# EAGLE design Laser engraver V2 (EAGLE 6.5.0)
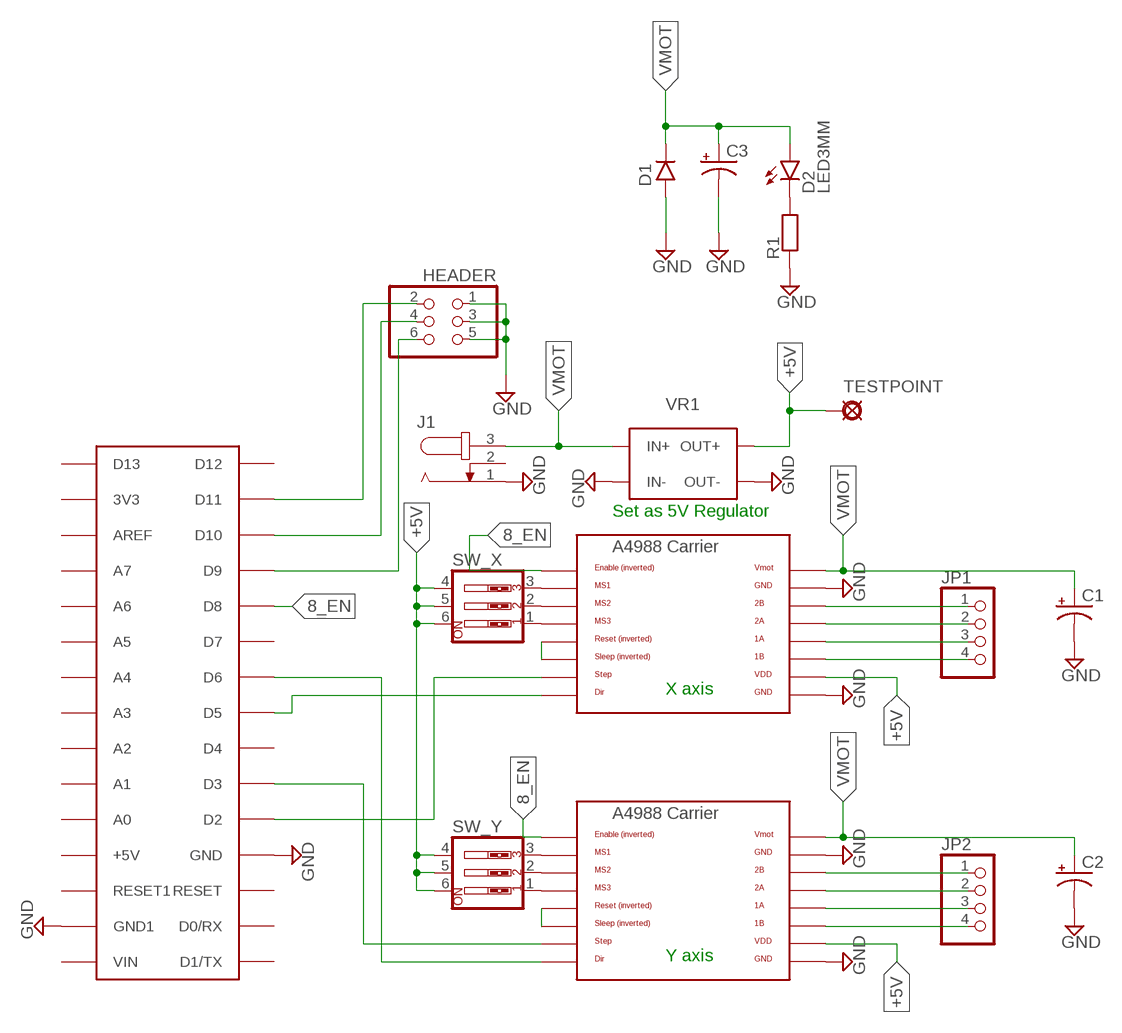
[diagram p0: schematic, sheet 1]

## Parts
C1  0501  [050_020_1]
C2  0501  [050_020_1]
C3  0631  [063_025]
D1  1N400X.3  [DO41-3]
D2  LED3MM  [LED3MM]
HEADER  PINHD-2X3  [2X03]
J1  JACK-PLUG0  [SPC4077]
JP1  PINHD-1X4  [1X04]
JP2  PINHD-1X4  [1X04]
MOTOR_X  A4988BREAKOUT  [A4988BREAKOUT]
MOTOR_Y  A4988BREAKOUT  [A4988BREAKOUT]
R1  6MM-EU  [R0207/3]
SW_X  SW_DIP-3  [EDG-03]
SW_Y  SW_DIP-3  [EDG-03]
TESTPOINT  PAD  [SQUARE]
U$3  ARDUINONANO  [PDIP-32]
VR1  VOLTAGE_REG_BANGGOOD  [VOLTAGE_REG]

## Nets
8_EN: MOTOR_X.EN MOTOR_Y.EN U$3.D8
+5V: MOTOR_X.VDD MOTOR_Y.VDD SW_X.4 SW_X.5 SW_X.6 SW_Y.4 SW_Y.5 SW_Y.6 TESTPOINT.1(PAD) VR1.O+1(OUT+) VR1.O+2(OUT+)
GND: C1.- C2.- C3.- D1.A HEADER.1 HEADER.3 HEADER.5 J1.1 MOTOR_X.GND MOTOR_X.GND@0(GND) MOTOR_Y.GND MOTOR_Y.GND@0(GND) R1.1 U$3.GND U$3.GND1 VR1.IN-1(IN-) VR1.IN-2(IN-) VR1.O-1(OUT-) VR1.O-2(OUT-)
N$1: MOTOR_X.MS3 SW_X.1
N$2: MOTOR_X.MS2 SW_X.2
N$3: MOTOR_X.MS1 SW_X.3
N$4: MOTOR_Y.MS3 SW_Y.1
N$5: MOTOR_Y.MS2 SW_Y.2
N$6: MOTOR_Y.MS1 SW_Y.3
N$7: HEADER.6 U$3.D9
N$8: MOTOR_X.DIR U$3.D5
N$9: MOTOR_X.STEP U$3.D2
N$10: MOTOR_Y.DIR U$3.D6
N$11: MOTOR_Y.STEP U$3.D3
N$12: MOTOR_Y.RST MOTOR_Y.SLP(SLEEP)
N$13: MOTOR_X.RST MOTOR_X.SLP(SLEEP)
N$14: HEADER.4 U$3.D10
N$15: HEADER.2 U$3.D11
N$17: JP1.1 MOTOR_X.2B
N$18: D2.K(C) R1.2
N$19: JP1.4 MOTOR_X.1B
N$20: JP1.3 MOTOR_X.1A
N$21: JP1.2 MOTOR_X.2A
N$22: JP2.1 MOTOR_Y.2B
N$23: JP2.2 MOTOR_Y.2A
N$24: JP2.3 MOTOR_Y.1A
N$25: JP2.4 MOTOR_Y.1B
VMOT: C1.+ C2.+ C3.+ D1.C D2.A J1.3 MOTOR_X.VMOT MOTOR_Y.VMOT VR1.IN+1(IN+) VR1.IN+2(IN+)
Unconnected: J1.2 U$3.3V3 U$3.+5V U$3.A0 U$3.A1 U$3.A2 U$3.A3 U$3.A4 U$3.A5 U$3.A6 U$3.A7 U$3.AREF U$3.D0/RX U$3.D1/TX U$3.D4 U$3.D7 U$3.D12 U$3.D13 U$3.RESET U$3.RESET1 U$3.VIN

## Notes on the sheet
- Set as 5V Regulator
- X axis
- Y axis

## Library data of the parts
C1 C2 = gm-caps-electro-pol:050: 0.22 - 100uF Xicon values at Mouser.com: 10V: 10 - 100uF; 16V: 2.2 - 47uF; 25V: 0.47 - 47uF; 50V: 0.22 - 22uF
C3 = gm-caps-electro-pol:063: 33 - 220uF Xicon values at Mouser.com 10V: 220uF; 16V: 100uF; 25V: 100uF; 50V: 33uF
D1 = gm-diodes:1N400X: Rectifier Diodes often used in power supply to prevent damage from reverse polarization
D2 = gm-diodes:LED
HEADER = pinhead:PINHD-2X3: PIN HEADER
J1 = con-jack:JACK-PLUG: DC POWER JACK Power Jack, DC, Right Angle, Through Hole, Rated 5A at 16VDC, PC Terminals Distributor: Farnell (www.Farnell.de) Drawing: 84N1161.pdf / 84N1162.pdf Manufacturer: SPC Technology (www.spctechnology.com) Type: SPC4077 / SPC 4078; OC_FARNELL: unknown; OC_NEWARK: unknown
JP1 JP2 = pinhead:PINHD-1X4: PIN HEADER
MOTOR_X MOTOR_Y = RepRapjr:A4988BREAKOUT
R1 = gm-resistors:6MM-EU: 6mm Resistors (European schematic symbol) Leads spaced 1-6 holes apart for 0.1" perfboard. Suitable for 1/4 watt resistors.
SW_X SW_Y = special:SW_DIP-3: DIP SWITCH
TESTPOINT = gm-supply:PAD: PAD use this package for pads with any purpose, including input, output, send or return various pad shapes: round, square, octogonal, long, and long offset
U$3 = jet-lib:ARDUINONANO
VR1 = GFE LOGO:VOLTAGE_REG_BANGGOOD

## Board
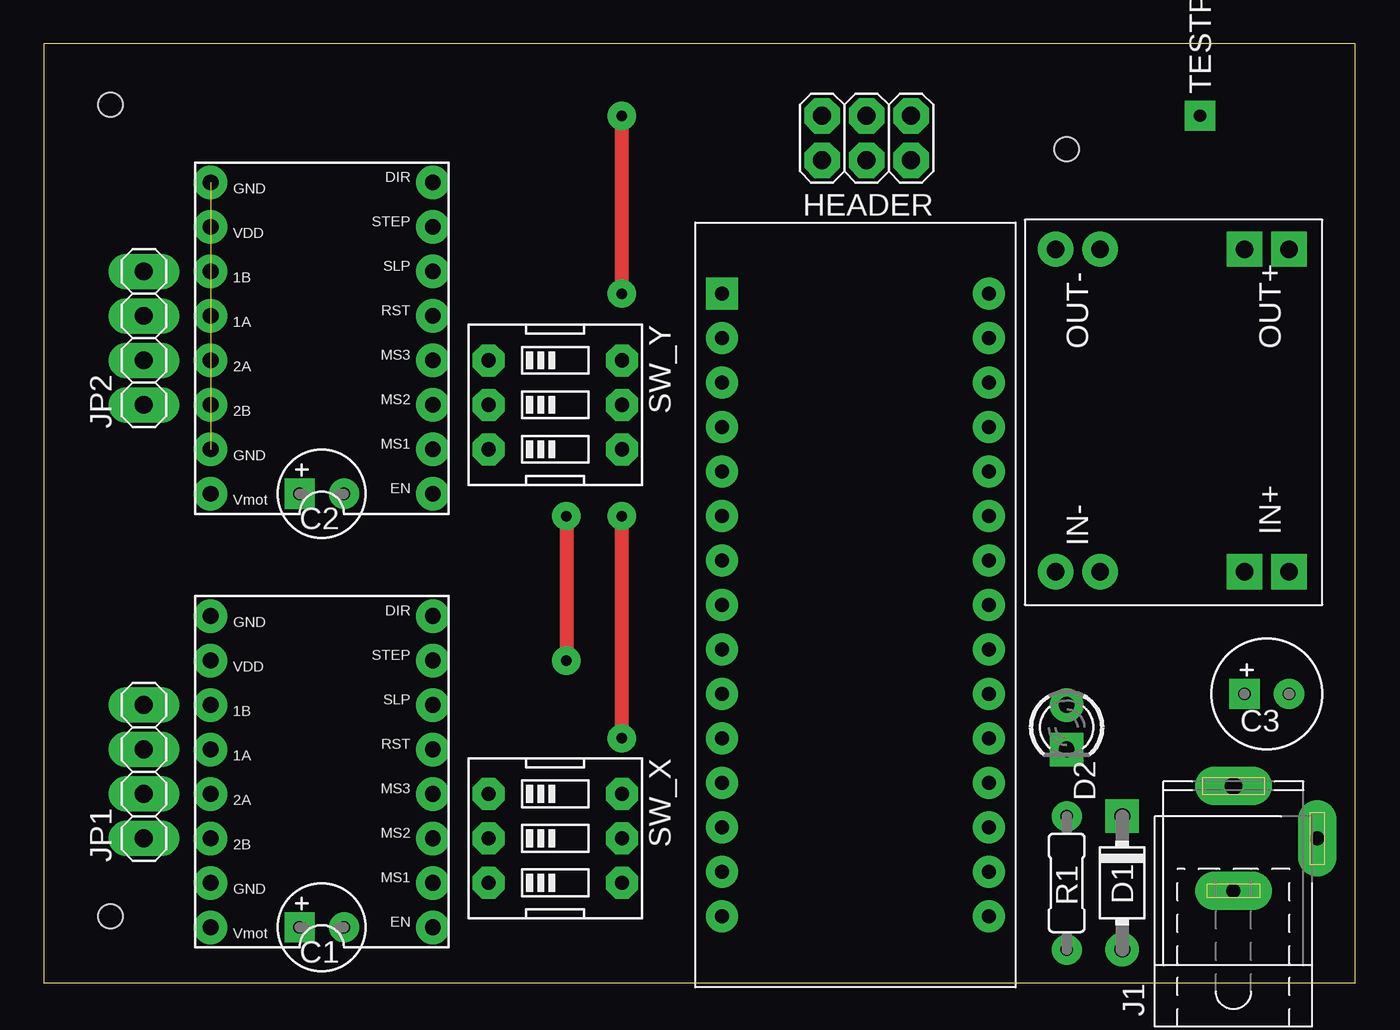
[diagram p1: board, top side]
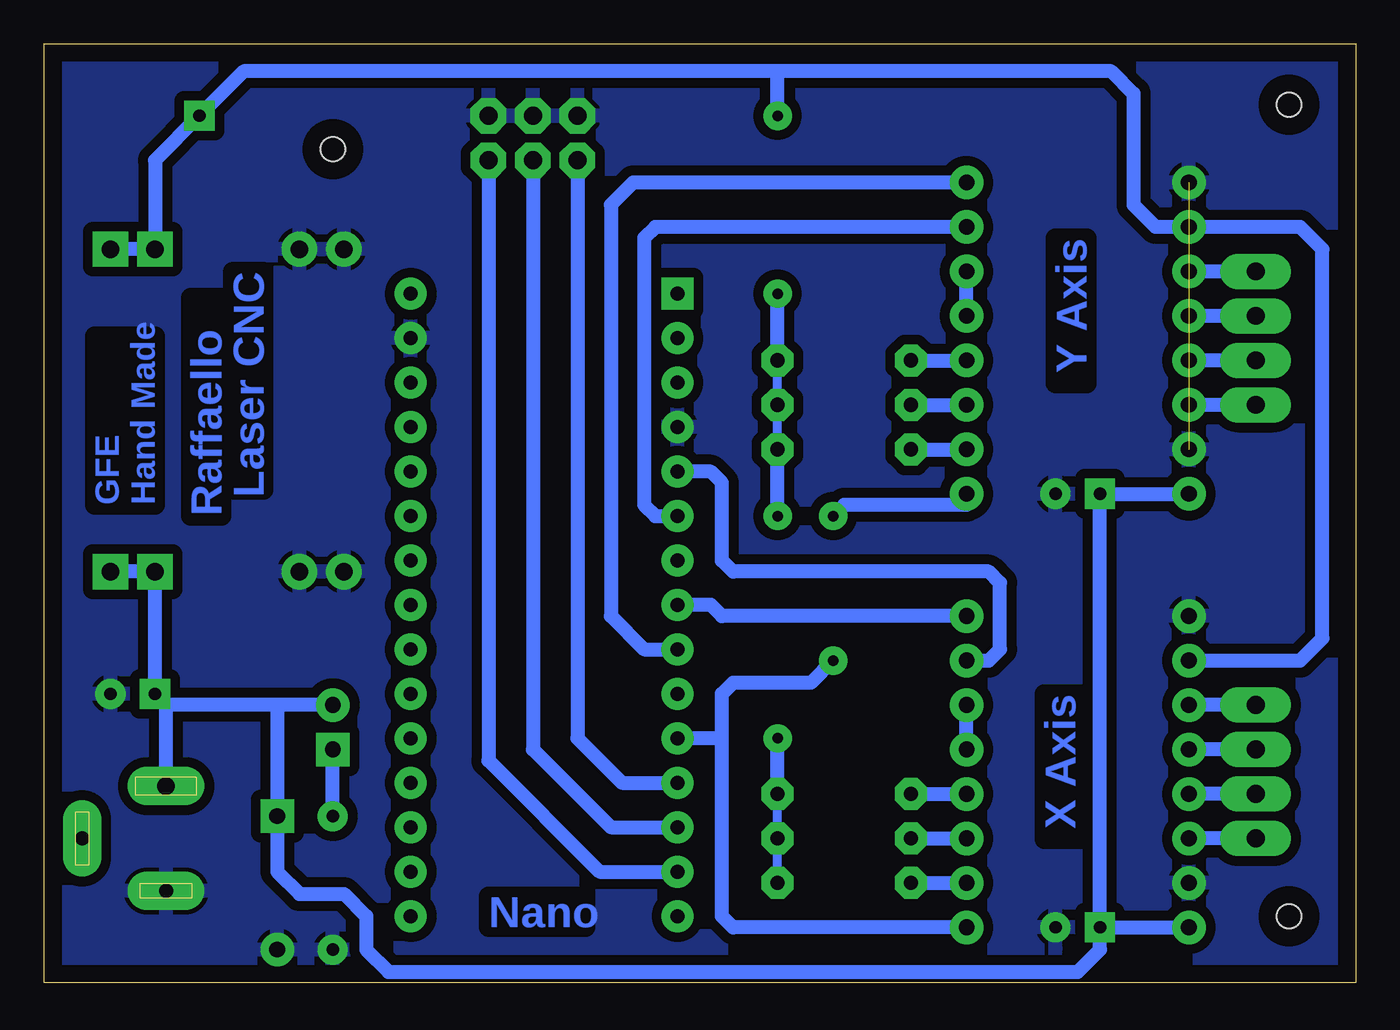
[diagram p2: board, bottom side, seen from below]

Size 74.91 x 53.65 mm. Coordinates in mm from the lower left corner, seen from the top.
Outline: 0,0 74.91,0 74.91,53.65 0,53.65 0,0
Copper layers (1*16): Top 0.035mm / dielectric 1.5mm / Bottom 0.035mm
Design rules "default *": minimum track width 10mil, minimum drill 24mil, track to track 8mil, track to pad 8mil, pad to pad 8mil, via to via 8mil, smd to smd 8mil, copper to edge 40mil, drill to drill 8mil, minimum pad ring 20mil, minimum via ring 20mil, stop-mask expansion 4mil, vias tented up to drill 0mil, thermal gap 10mil
Holes 1.4 mm at 3.81,3.81 58.42,47.62 3.81,50.16

### Footprints (pad centres in the part's own frame; a part is rotated, then mirrored left to right if it is on the bottom)
050_020_1 = drill 0.7 square: + -1.27,0 | drill 0.7: - 1.27,0
063_025 = drill 0.7 square: + -1.27,0 | drill 0.7: - 1.27,0
DO41-3 = drill 0.9: A 3.81,0 | drill 0.9 square: C -3.81,0
LED3MM = drill 0.9: A -1.27,0 | drill 0.9 square: K 1.27,0
2X03 = drill 1.016 octagon: 1 -2.54,-1.27; 2 -2.54,1.27; 3 0,-1.27; 4 0,1.27; 5 2.54,-1.27; 6 2.54,1.27
SPC4077 = drill 0.8 pad 2.184 long: 1 -3,0; 2 0,-4.8 | drill 1 pad 2.184 long: 3 3,0
1X04 = drill 1.016 long: 1 -3.81,0; 2 -1.27,0; 3 1.27,0; 4 3.81,0
A4988BREAKOUT = drill 0.9: 1A 8.89,1.27; 1B 11.43,1.27; 2A 6.35,1.27; 2B 3.81,1.27; DIR 16.51,-11.43; EN -1.27,-11.43; GND 16.51,1.27; GND@0 1.27,1.27; MS1 1.27,-11.43; MS2 3.81,-11.43; MS3 6.35,-11.43; RST 8.89,-11.43; SLP 11.43,-11.43; STEP 13.97,-11.43; VDD 13.97,1.27; VMOT -1.27,1.27
R0207/3 = drill 0.7: 1 -3.81,0; 2 3.81,0
EDG-03 = drill 0.813 octagon: 1 -2.54,-3.81; 2 0,-3.81; 3 2.54,-3.81; 4 2.54,3.81; 5 0,3.81; 6 -2.54,3.81
SQUARE = drill 0.7 square: 1 0,0
PDIP-32 = drill 0.8 pad 1.778: 3V3 15.24,-35.56; +5V 15.24,-10.16; A0 15.24,-30.48; A1 15.24,-27.94; A2 15.24,-25.4; A3 15.24,-22.86; A4 15.24,-20.32; A5 15.24,-17.78; A6 15.24,-15.24; A7 15.24,-12.7; AREF 15.24,-33.02; D0/RX 0,-5.08; D2 0,-12.7; D3 0,-15.24; D4 0,-17.78; D5 0,-20.32; D6 0,-22.86; D7 0,-25.4; D8 0,-27.94; D9 0,-30.48; D10 0,-33.02; D11 0,-35.56; D12 0,-38.1; D13 15.24,-38.1; GND 0,-10.16; GND1 15.24,-5.08; RESET 0,-7.62; RESET1 15.24,-7.62; VIN 15.24,-2.54 | drill 0.8 pad 1.778 square: D1/TX 0,-2.54
VOLTAGE_REG = drill 1 square: IN+1 0,0; IN+2 0,2.54; O+1 18.415,0; O+2 18.415,2.54 | drill 1: IN-1 0,10.795; IN-2 0,13.335; O-1 18.415,10.795; O-2 18.415,13.335

### Placement (x,y rotation side)
C1  15.88,3.17 0 top
C2  15.88,27.94 0 top
C3  69.85,16.51 0 top
D1  61.59,5.71 270 top
D2  58.42,14.61 270 top
HEADER  46.99,48.26 180 top
J1  67.94,8.26 90 top
JP1  5.71,12.06 90 top
JP2  5.71,36.83 90 top
MOTOR_X  10.79,4.45 90 top
MOTOR_Y  10.79,29.21 90 top
R1  58.42,5.71 90 top
SW_X  29.21,8.26 270 top
SW_Y  29.21,33.02 270 top
TESTPOINT  66.04,49.53 90 top
U$3  38.73,41.91 0 top
VR1  71.12,23.5 90 top

### Tracks (layer width: path | path; a pad name or v marks a point on that pad's centre or on a via)
8_EN  (via drill 0.6)
  Top 0.813: v29.84,26.67 v29.84,18.41
  Bottom 0.813: MOTOR_X.EN 35.56,3.17 36.2,3.81 36.2,13.97 | 36.2,13.97 36.2,16.51 35.56,17.14 31.11,17.14 v29.84,18.41 | 36.2,13.97 U$3.D8 | MOTOR_Y.EN 22.23,27.3 29.21,27.3 v29.84,26.67
+5V  (via drill 0.6)
  Top 0.813: v33.02,13.97 v33.02,26.67 | v33.02,39.37 v33.02,49.53
  Bottom 0.508: SW_X.4 SW_X.5 SW_X.6 | SW_Y.4 SW_Y.5 SW_Y.6
  Bottom 0.813: SW_X.6 v33.02,13.97 | v33.02,26.67 SW_Y.4 | SW_Y.6 v33.02,39.37 | 33.02,52.07 13.97,52.07 12.7,50.8 12.7,44.45 11.43,43.18 MOTOR_Y.VDD 3.17,43.18 1.91,41.91 1.91,19.68 3.17,18.41 MOTOR_X.VDD | 33.02,52.07 63.5,52.07 TESTPOINT.1 68.58,46.99 VR1.O+2 VR1.O+1 | v33.02,49.53 33.02,52.07
GND  (1 unrouted)
  pour Bottom (isolate 0.559): -1.91,-1.27 76.2,-1.27 76.2,54.61 -2.54,54.61
N$1
  Bottom 0.813: SW_X.1 MOTOR_X.MS3
N$2
  Bottom 0.813: SW_X.2 MOTOR_X.MS2
N$3
  Bottom 0.813: SW_X.3 MOTOR_X.MS1
N$4
  Bottom 0.813: SW_Y.1 MOTOR_Y.MS3
N$5
  Bottom 0.813: SW_Y.2 MOTOR_Y.MS2
N$6
  Bottom 0.813: SW_Y.3 MOTOR_Y.MS1
N$7
  Bottom 0.813: HEADER.6 44.45,13.97 41.91,11.43 U$3.D9
N$8
  Bottom 0.813: MOTOR_X.DIR 36.2,20.95 36.83,21.59 U$3.D5
N$9
  Bottom 0.813: MOTOR_X.STEP 20.95,18.41 20.32,19.05 20.32,22.86 20.95,23.5 35.56,23.5 36.2,24.13 36.2,28.57 36.83,29.21 U$3.D2
N$10
  Bottom 0.813: MOTOR_Y.DIR 41.27,45.72 42.55,44.45 42.55,20.95 40.64,19.05 U$3.D6
N$11
  Bottom 0.813: MOTOR_Y.STEP 40.01,43.18 40.64,42.55 40.64,27.3 40.01,26.67 U$3.D3
N$12
  Bottom 0.813: MOTOR_Y.RST MOTOR_Y.SLP
N$13
  Bottom 0.813: MOTOR_X.RST MOTOR_X.SLP
N$14
  Bottom 0.813: HEADER.4 46.99,13.34 42.55,8.89 U$3.D10
N$15
  Bottom 0.813: HEADER.2 49.53,12.7 43.18,6.35 U$3.D11
N$17
  Bottom 0.813: JP1.1 MOTOR_X.2B
N$18
  Bottom 0.813: R1.2 D2.K
N$19
  Bottom 0.813: JP1.4 MOTOR_X.1B
N$20
  Bottom 0.813: JP1.3 MOTOR_X.1A
N$21
  Bottom 0.813: JP1.2 MOTOR_X.2A
N$22
  Bottom 0.813: JP2.1 MOTOR_Y.2B
N$23
  Bottom 0.813: JP2.2 MOTOR_Y.2A
N$24
  Bottom 0.813: JP2.3 MOTOR_Y.1A
N$25
  Bottom 0.813: JP2.4 MOTOR_Y.1B
VMOT
  Bottom 0.813: J1.3 67.94,15.88 | 67.94,15.88 C3.+ VR1.IN+2 VR1.IN+1 | 61.59,15.88 67.94,15.88 | MOTOR_Y.VMOT C2.+ C1.+ | C1.+ MOTOR_X.VMOT | D2.A 61.59,15.88 | 61.59,15.88 D1.C 61.59,6.35 60.33,5.08 57.78,5.08 56.52,3.81 56.52,1.91 55.24,0.64 15.88,0.64 14.61,1.91 C1.+

### Text on the board
Bottom: Y Axis | Laser CNC | Raffaello | GFE / Hand Made | X Axis | Nano